# Altium project muhendislik_tasarim.PrjPcb
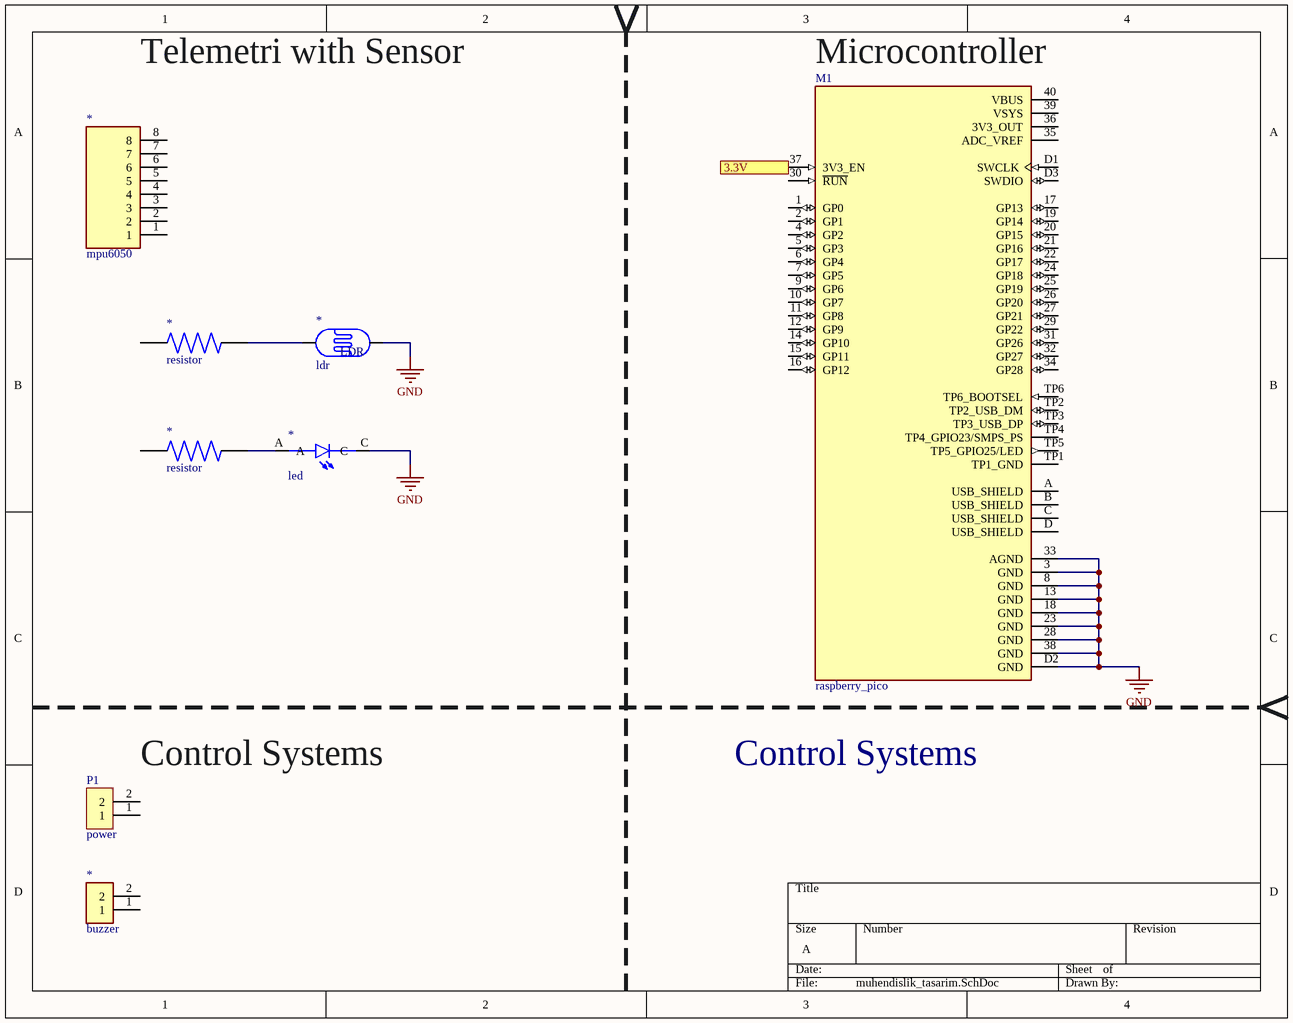
[diagram p0: muhendislik_tasarim.SchDoc]
2 sheets, 8 parts. Net scope: flat (ports and power ports of the same name join across sheets).
Board file: muhendislik_tasarim.PcbDoc
Sheets:
  muhendislik_tasarim.SchDoc
  table_of_companents.SchDoc

## Sheet muhendislik_tasarim.SchDoc
size A; SheetNumber: 1; SheetTotal: 2

### Parts
(Parts that share a designator on the sheet are numbered #1, #2 ... from top to bottom, then left to right.)
*#1  mpu6050  [mpu6050]
*#2  resistor  [resistor]
*#3  ldr  [ldr]
*#4  resistor  [resistor]
*#5  led  [led]
*#6  buzzer  [buzzer]
M1  raspberry_pico  [raspberry_pico]
P1  power  [power]

### Ports
3.3V

### Nets
GND: *#3.2(P$2) *#5.C M1.3(GND) M1.8(GND) M1.13(GND) M1.18(GND) M1.23(GND) M1.28(GND) M1.33(AGND) M1.38(GND) M1.D2(GND)
Net*#2_2: *#2.2 *#3.1(P$1)
Net*#4_2: *#4.2 *#5.A
NetM1_37: M1.37(3V3_EN) ; port 3.3V

Not connected (* = marked no-connect by the designer): *#1 1 2 3 4 5 6 7 8; *#2 1; *#4 1; *#6 1 2; M1 1(GP0) 2(GP1) 4(GP2) 5(GP3) 6(GP4) 7(GP5) 9(GP6) 10(GP7) 11(GP8) 12(GP9) 14(GP10) 15(GP11) 16(GP12) 17(GP13) 19(GP14) 20(GP15) 21(GP16) 22(GP17) 24(GP18) 25(GP19) 26(GP20) 27(GP21) 29(GP22) 30(~{RUN}) 31(GP26) 32(GP27) 34(GP28) 35(ADC_VREF) 36(3V3_OUT) 39(VSYS) 40(VBUS) A(USB_SHIELD) B(USB_SHIELD) C(USB_SHIELD) D(USB_SHIELD) D1(SWCLK) D3(SWDIO) TP1(TP1_GND) TP2(TP2_USB_DM) TP3(TP3_USB_DP) TP4(TP4_GPIO23/SMPS_PS) TP5(TP5_GPIO25/LED) TP6(TP6_BOOTSEL); P1 1 2

### Notes on the sheet
- Telemetri with Sensor
- (near M1) Microcontroller
- (near P1) Control Systems
- Control Systems
- (in symbol ldr) LDR

## Sheet table_of_companents.SchDoc
size A; SheetNumber: 2; SheetTotal: 2
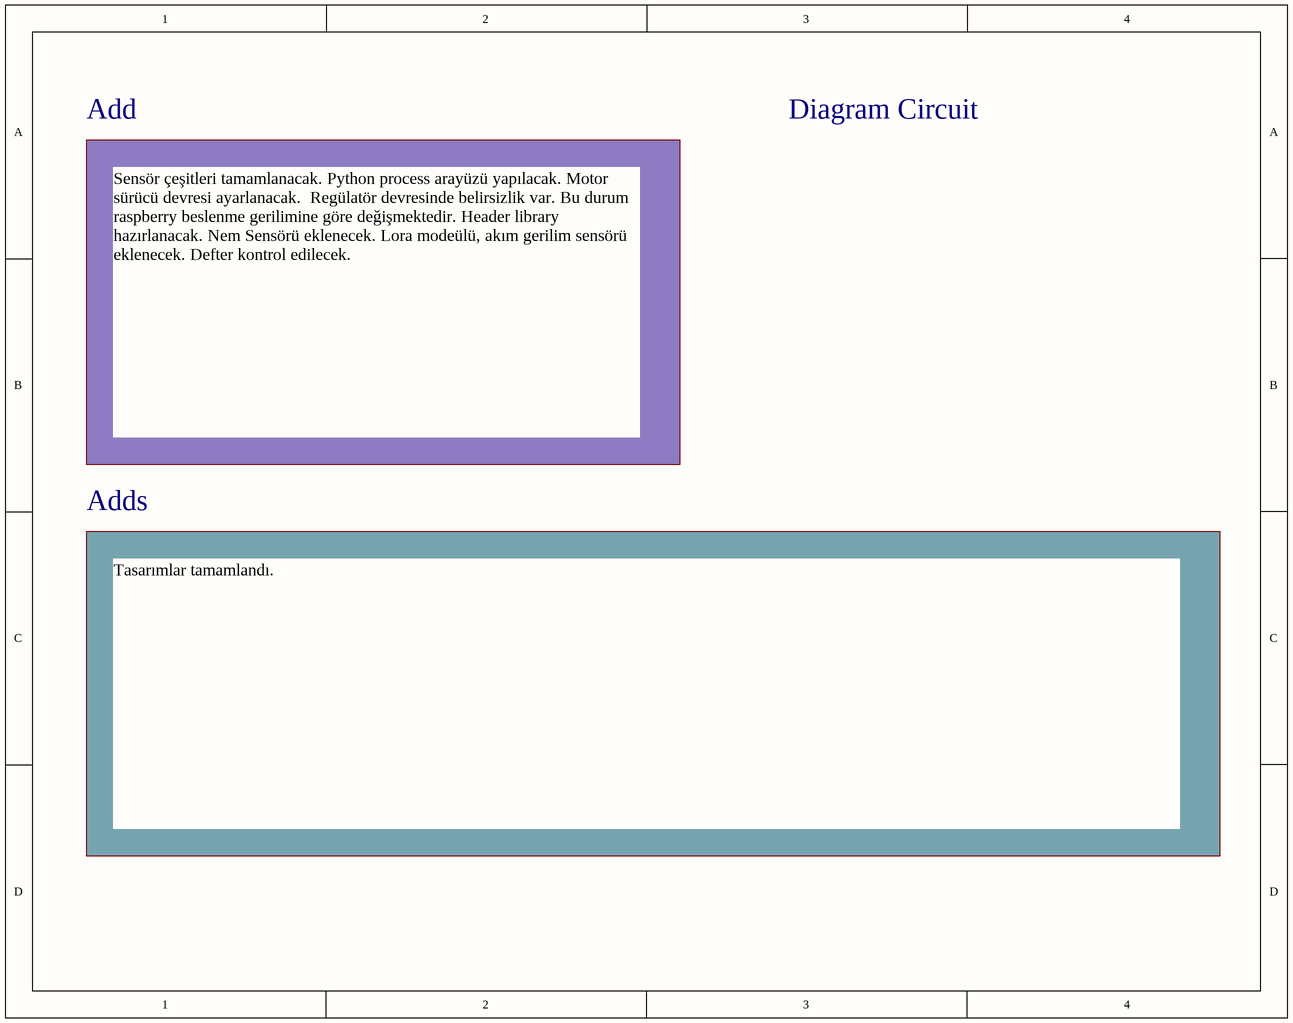
[diagram p1: table_of_companents.SchDoc]

### Notes on the sheet
- Add
- Diagram Circuit
- Sensör çeşitleri tamamlanacak. Python process arayüzü yapılacak. Motor sürücü devresi ayarlanacak.  Regülatör devresinde belirsizlik var. Bu durum raspberry beslenme gerilimine göre değişmektedir. Header library hazırlanacak. Nem Sensörü eklenecek. Lora modeülü, akım gerilim sensörü eklenecek. Defter kontrol edilecek.
- Adds
- Tasarımlar tamamlandı.